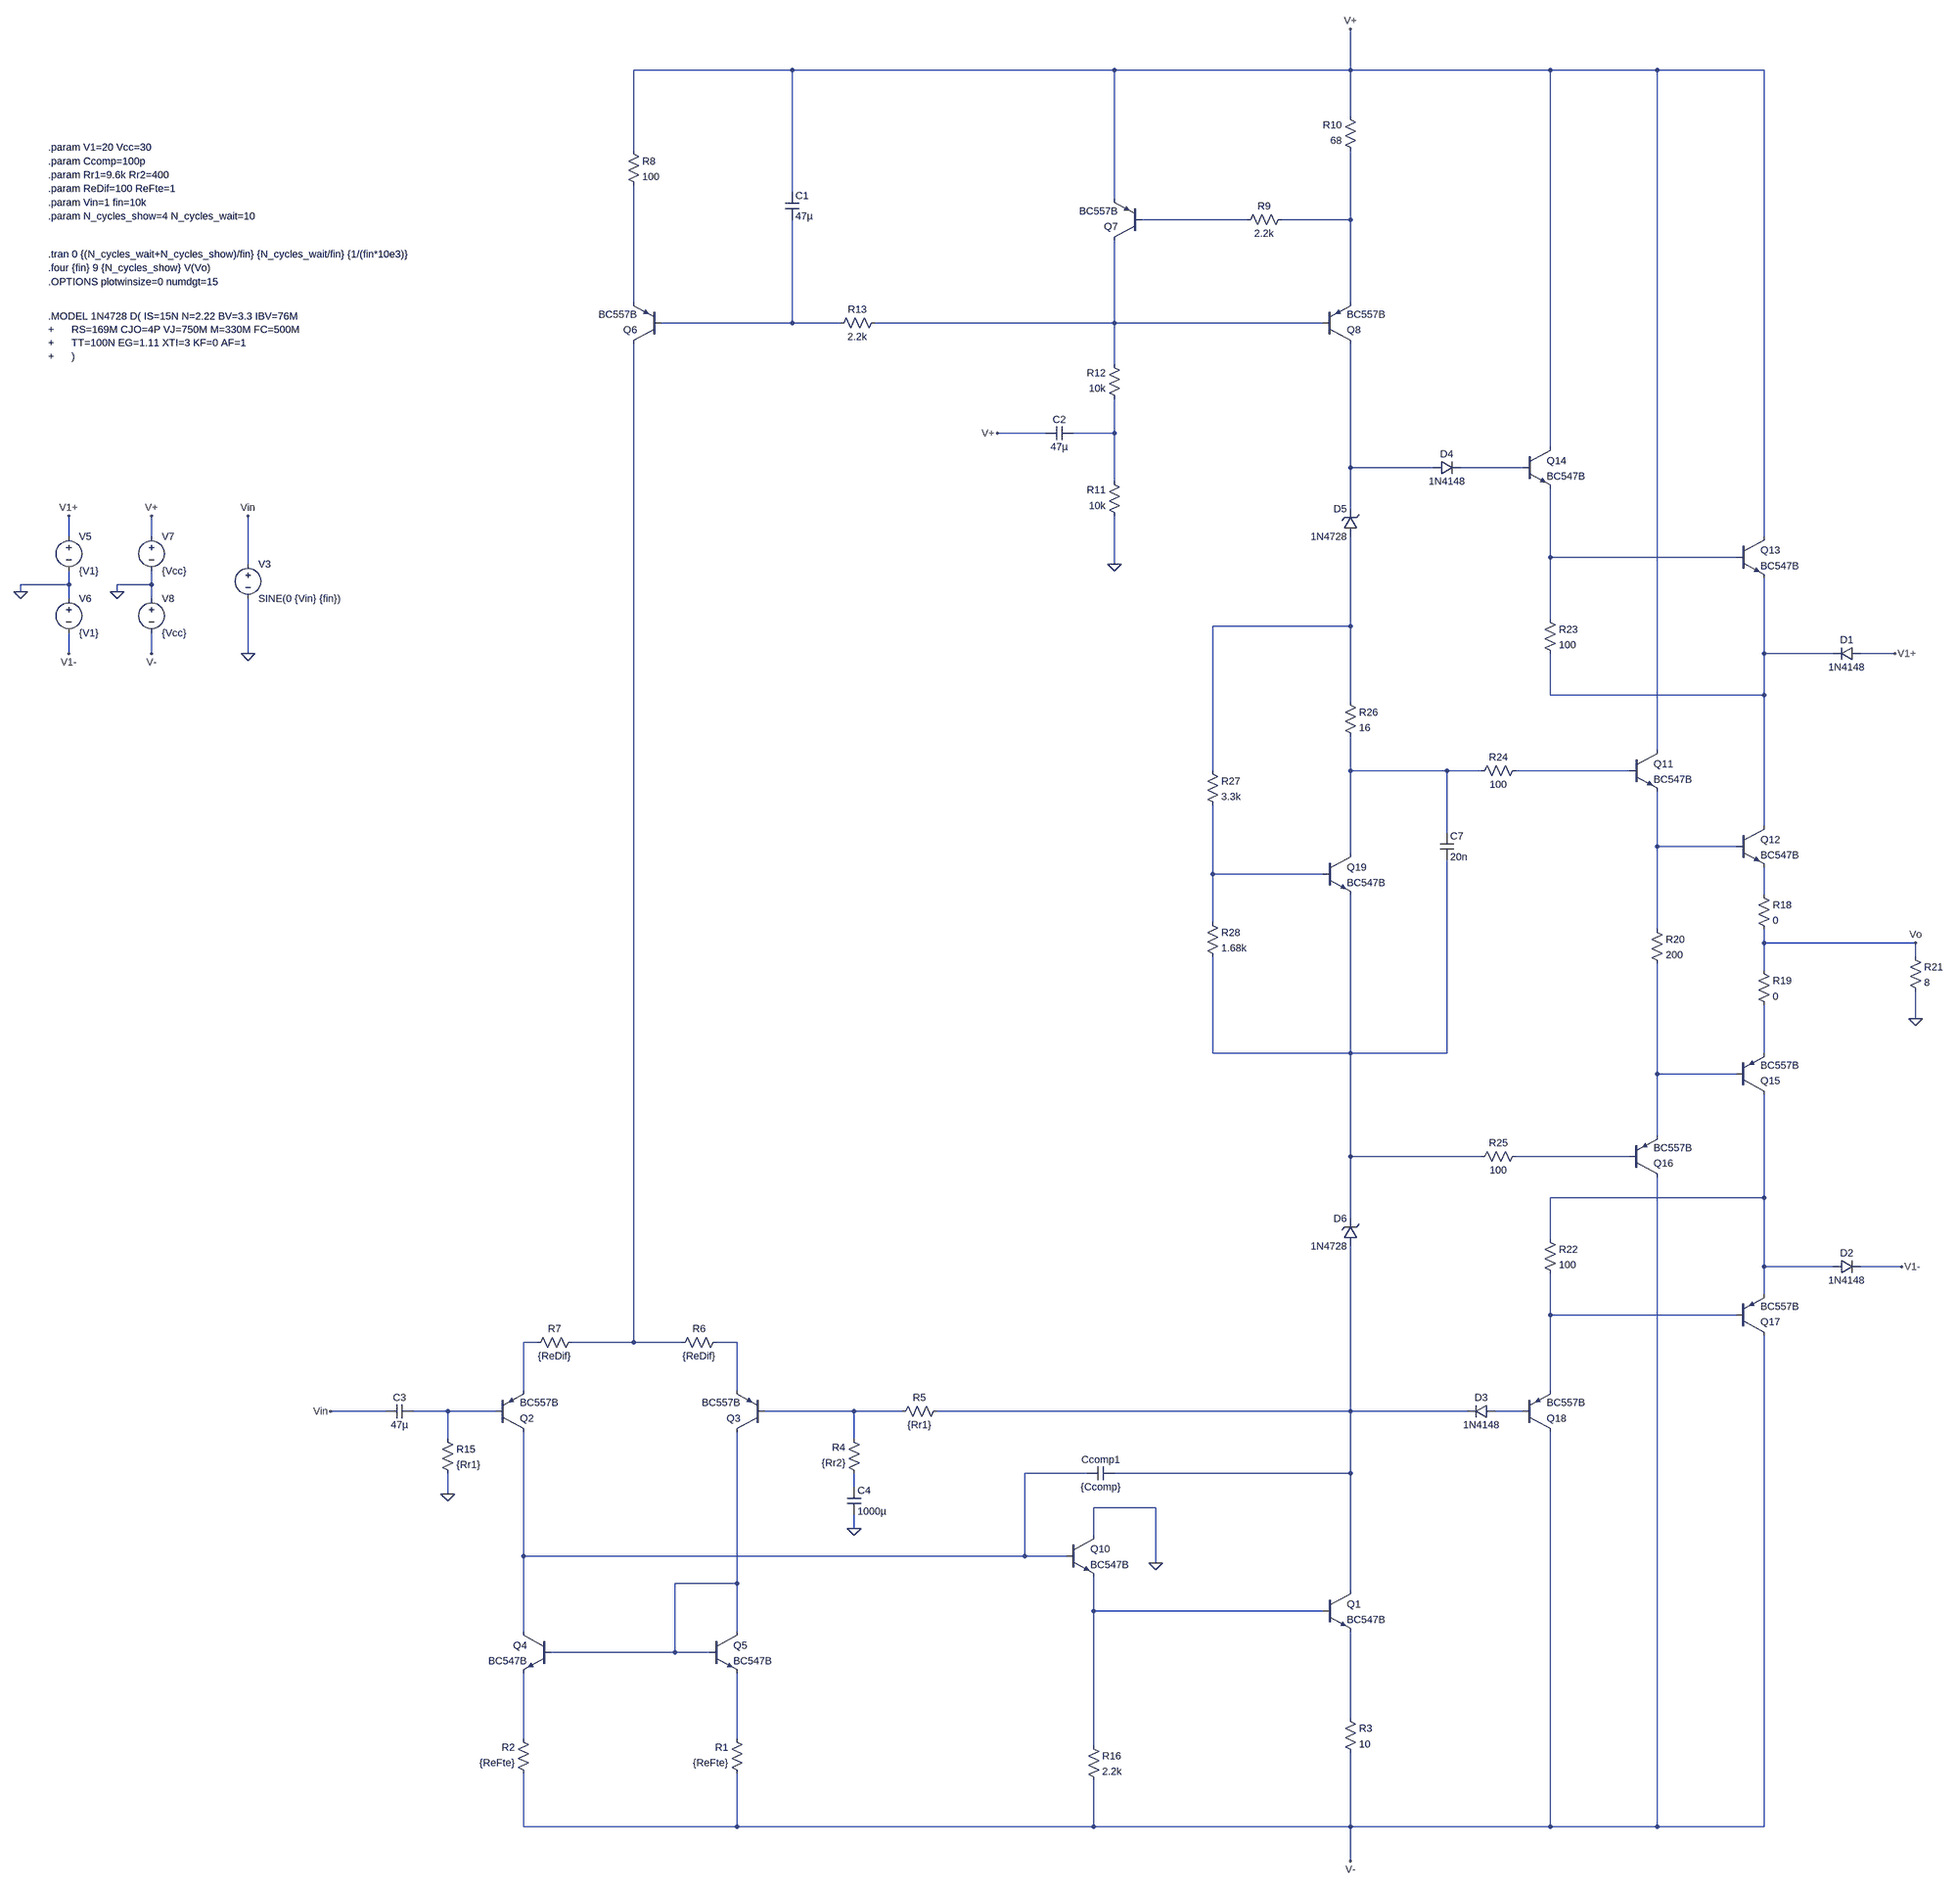
[diagram p0: schematic total.asc]
total.asc, the LTspice schematic file:
Version 4
SHEET 1 7264 2156
WIRE -1120 -2688 -1488 -2688
WIRE -368 -2688 -1120 -2688
WIRE 192 -2688 192 -2784
WIRE 192 -2688 -368 -2688
WIRE 656 -2688 192 -2688
WIRE 976 -2688 656 -2688
WIRE 1296 -2688 976 -2688
WIRE 192 -2576 192 -2688
WIRE -1488 -2496 -1488 -2688
WIRE -1120 -2400 -1120 -2688
WIRE -368 -2384 -368 -2688
WIRE -48 -2336 -304 -2336
WIRE 192 -2336 192 -2496
WIRE 192 -2336 32 -2336
WIRE -1488 -2144 -1488 -2416
WIRE 192 -2144 192 -2336
WIRE -1120 -2096 -1120 -2336
WIRE -1120 -2096 -1424 -2096
WIRE -1008 -2096 -1120 -2096
WIRE -368 -2096 -368 -2288
WIRE -368 -2096 -928 -2096
WIRE 128 -2096 -368 -2096
WIRE -368 -2000 -368 -2096
WIRE -528 -1840 -640 -1840
WIRE -368 -1840 -368 -1920
WIRE -368 -1840 -464 -1840
WIRE 656 -1808 656 -2688
WIRE 192 -1760 192 -2048
WIRE 384 -1760 192 -1760
WIRE 592 -1760 448 -1760
WIRE -368 -1728 -368 -1840
WIRE 192 -1664 192 -1760
WIRE -2800 -1600 -2800 -1648
WIRE -2608 -1600 -2608 -1648
WIRE 1296 -1600 1296 -2688
WIRE 656 -1552 656 -1712
WIRE 1232 -1552 656 -1552
WIRE -2384 -1536 -2384 -1648
WIRE -368 -1536 -368 -1648
WIRE -2800 -1488 -2800 -1520
WIRE -2800 -1488 -2912 -1488
WIRE -2608 -1488 -2608 -1520
WIRE -2608 -1488 -2688 -1488
WIRE -2912 -1472 -2912 -1488
WIRE -2688 -1472 -2688 -1488
WIRE -2800 -1456 -2800 -1488
WIRE -2608 -1456 -2608 -1488
WIRE 656 -1408 656 -1552
WIRE 192 -1392 192 -1600
WIRE 192 -1392 -128 -1392
WIRE -2800 -1328 -2800 -1376
WIRE -2608 -1328 -2608 -1376
WIRE -2384 -1328 -2384 -1456
WIRE 1296 -1328 1296 -1504
WIRE 1456 -1328 1296 -1328
WIRE 1600 -1328 1520 -1328
WIRE 656 -1232 656 -1328
WIRE 1296 -1232 1296 -1328
WIRE 1296 -1232 656 -1232
WIRE 192 -1216 192 -1392
WIRE 976 -1104 976 -2688
WIRE -128 -1056 -128 -1392
WIRE 192 -1056 192 -1136
WIRE 416 -1056 192 -1056
WIRE 496 -1056 416 -1056
WIRE 912 -1056 576 -1056
WIRE 1296 -928 1296 -1232
WIRE 416 -912 416 -1056
WIRE 976 -880 976 -1008
WIRE 1232 -880 976 -880
WIRE 192 -864 192 -1056
WIRE -128 -816 -128 -976
WIRE 128 -816 -128 -816
WIRE 1296 -768 1296 -832
WIRE -128 -704 -128 -816
WIRE 976 -688 976 -880
WIRE 1296 -656 1296 -688
WIRE 1648 -656 1296 -656
WIRE 1648 -624 1648 -656
WIRE 1296 -592 1296 -656
WIRE 1648 -480 1648 -544
WIRE -128 -400 -128 -624
WIRE 192 -400 192 -768
WIRE 192 -400 -128 -400
WIRE 416 -400 416 -848
WIRE 416 -400 192 -400
WIRE 1296 -400 1296 -512
WIRE 976 -352 976 -608
WIRE 1232 -352 976 -352
WIRE 976 -208 976 -352
WIRE 192 -160 192 -400
WIRE 496 -160 192 -160
WIRE 912 -160 576 -160
WIRE 1296 -64 1296 -304
WIRE 1296 -64 656 -64
WIRE 192 -16 192 -160
WIRE 656 32 656 -64
WIRE 1296 96 1296 -64
WIRE 1456 96 1296 96
WIRE 1616 96 1520 96
WIRE 1296 160 1296 96
WIRE 656 208 656 112
WIRE 1232 208 656 208
WIRE -1712 272 -1744 272
WIRE -1488 272 -1488 -2048
WIRE -1488 272 -1632 272
WIRE -1376 272 -1488 272
WIRE -1248 272 -1296 272
WIRE -1744 384 -1744 272
WIRE -1248 384 -1248 272
WIRE 656 384 656 208
WIRE -2064 432 -2192 432
WIRE -1920 432 -2000 432
WIRE -1808 432 -1920 432
WIRE -976 432 -1184 432
WIRE -864 432 -976 432
WIRE 192 432 192 48
WIRE 192 432 -784 432
WIRE 464 432 192 432
WIRE 592 432 528 432
WIRE -1920 496 -1920 432
WIRE -976 496 -976 432
WIRE -432 576 -576 576
WIRE 192 576 192 432
WIRE 192 576 -368 576
WIRE -976 608 -976 576
WIRE -1920 624 -1920 576
WIRE -272 656 -416 656
WIRE -976 704 -976 672
WIRE -416 720 -416 656
WIRE -1744 768 -1744 480
WIRE -576 768 -576 576
WIRE -576 768 -1744 768
WIRE -480 768 -576 768
WIRE -272 784 -272 656
WIRE -1248 832 -1248 480
WIRE -1248 832 -1392 832
WIRE 192 848 192 576
WIRE -416 896 -416 816
WIRE 128 896 -416 896
WIRE -1744 944 -1744 768
WIRE -1248 944 -1248 832
WIRE -1392 992 -1392 832
WIRE -1392 992 -1680 992
WIRE -1312 992 -1392 992
WIRE 192 1168 192 944
WIRE -1744 1216 -1744 1040
WIRE -1248 1216 -1248 1040
WIRE -416 1232 -416 896
WIRE -1744 1520 -1744 1296
WIRE -1248 1520 -1248 1296
WIRE -1248 1520 -1744 1520
WIRE -416 1520 -416 1312
WIRE -416 1520 -1248 1520
WIRE 192 1520 192 1248
WIRE 192 1520 -416 1520
WIRE 656 1520 656 480
WIRE 656 1520 192 1520
WIRE 976 1520 976 -112
WIRE 976 1520 656 1520
WIRE 1296 1520 1296 256
WIRE 1296 1520 976 1520
WIRE 192 1600 192 1520
FLAG -2384 -1328 0
FLAG -2384 -1648 Vin
FLAG -368 -1536 0
FLAG -640 -1840 V+
FLAG -976 704 0
FLAG -1920 624 0
FLAG -2192 432 Vin
FLAG -272 784 0
FLAG 192 1600 V-
FLAG 192 -2784 V+
FLAG 1648 -480 0
FLAG 1600 -1328 V1+
FLAG 1616 96 V1-
FLAG -2912 -1472 0
FLAG -2688 -1472 0
FLAG -2800 -1328 V1-
FLAG -2800 -1648 V1+
FLAG -2608 -1648 V+
FLAG -2608 -1328 V-
FLAG 1648 -656 Vo
DATAFLAG -1248 672 ""
DATAFLAG -1248 1136 "Ie(Q8)"
DATAFLAG -1744 1136 "Ie(Q7)"
DATAFLAG 192 1392 "I(R1)"
DATAFLAG -160 432 "I(R4)"
DATAFLAG 192 432 ""
DATAFLAG 192 704 "Ic(Q3)"
DATAFLAG -976 432 ""
DATAFLAG -1744 336 ""
DATAFLAG -1248 320 ""
DATAFLAG -1408 992 ""
DATAFLAG -1744 544 "Ic(Q1)"
DATAFLAG -1744 864 "Ic(Q7)"
DATAFLAG -1488 272 ""
DATAFLAG -1488 -1632 "Ic(Q4)"
DATAFLAG -1920 432 ""
DATAFLAG 192 -160 ""
DATAFLAG 192 -1392 ""
DATAFLAG 192 -1056 ""
DATAFLAG 1424 -656 ""
DATAFLAG 800 -1056 ""
DATAFLAG 784 -160 ""
DATAFLAG 976 -880 ""
SYMBOL res -1232 1312 R180
WINDOW 0 36 76 Left 2
WINDOW 3 36 40 Left 2
SYMATTR InstName R1
SYMATTR Value {ReFte}
SYMBOL res -1728 1312 R180
WINDOW 0 36 76 Left 2
WINDOW 3 36 40 Left 2
SYMATTR InstName R2
SYMATTR Value {ReFte}
SYMBOL npn 128 848 R0
SYMATTR InstName Q1
SYMATTR Value BC547B
SYMBOL voltage -2384 -1552 R0
WINDOW 123 0 0 Left 2
WINDOW 39 0 0 Left 2
SYMATTR InstName V3
SYMATTR Value SINE(0 {Vin} {fin})
SYMBOL res 176 1152 R0
SYMATTR InstName R3
SYMATTR Value 10
SYMBOL res -960 592 R180
WINDOW 0 36 76 Left 2
WINDOW 3 36 40 Left 2
SYMATTR InstName R4
SYMATTR Value {Rr2}
SYMBOL pnp -1808 480 M180
SYMATTR InstName Q2
SYMATTR Value BC557B
SYMBOL pnp -1184 480 R180
SYMATTR InstName Q3
SYMATTR Value BC557B
SYMBOL npn -1680 944 M0
SYMATTR InstName Q4
SYMATTR Value BC547B
SYMBOL npn -1312 944 R0
SYMATTR InstName Q5
SYMATTR Value BC547B
SYMBOL res -768 416 R90
WINDOW 0 0 56 VBottom 2
WINDOW 3 32 56 VTop 2
SYMATTR InstName R5
SYMATTR Value {Rr1}
SYMBOL res -1280 256 R90
WINDOW 0 0 56 VBottom 2
WINDOW 3 32 56 VTop 2
SYMATTR InstName R6
SYMATTR Value {ReDif}
SYMBOL res -1616 256 R90
WINDOW 0 0 56 VBottom 2
WINDOW 3 32 56 VTop 2
SYMATTR InstName R7
SYMATTR Value {ReDif}
SYMBOL pnp -1424 -2048 R180
SYMATTR InstName Q6
SYMATTR Value BC557B
SYMBOL pnp -304 -2288 R180
SYMATTR InstName Q7
SYMATTR Value BC557B
SYMBOL pnp 128 -2048 M180
SYMATTR InstName Q8
SYMATTR Value BC557B
SYMBOL cap -1136 -2400 R0
SYMATTR InstName C1
SYMATTR Value 47µ
SYMBOL cap -528 -1824 R270
WINDOW 0 32 32 VTop 2
WINDOW 3 0 32 VBottom 2
SYMATTR InstName C2
SYMATTR Value 47µ
SYMBOL res -1504 -2512 R0
SYMATTR InstName R8
SYMATTR Value 100
SYMBOL res 48 -2352 R90
WINDOW 0 0 56 VBottom 2
WINDOW 3 32 56 VTop 2
SYMATTR InstName R9
SYMATTR Value 2.2k
SYMBOL res 208 -2480 R180
WINDOW 0 36 76 Left 2
WINDOW 3 36 40 Left 2
SYMATTR InstName R10
SYMATTR Value 68
SYMBOL res -352 -1632 R180
WINDOW 0 36 76 Left 2
WINDOW 3 36 40 Left 2
SYMATTR InstName R11
SYMATTR Value 10k
SYMBOL res -352 -1904 R180
WINDOW 0 36 76 Left 2
WINDOW 3 36 40 Left 2
SYMATTR InstName R12
SYMATTR Value 10k
SYMBOL res -1024 -2080 R270
WINDOW 0 32 56 VTop 2
WINDOW 3 0 56 VBottom 2
SYMATTR InstName R13
SYMATTR Value 2.2k
SYMBOL res -1936 480 R0
SYMATTR InstName R15
SYMATTR Value {Rr1}
SYMBOL cap -2000 416 R90
WINDOW 0 0 32 VBottom 2
WINDOW 3 32 32 VTop 2
SYMATTR InstName C3
SYMATTR Value 47µ
SYMBOL cap -992 608 R0
SYMATTR InstName C4
SYMATTR Value 1000µ
SYMBOL npn -480 720 R0
SYMATTR InstName Q10
SYMATTR Value BC547B
SYMBOL res -432 1216 R0
SYMATTR InstName R16
SYMATTR Value 2.2k
SYMBOL cap -368 560 R90
WINDOW 0 0 32 VBottom 2
WINDOW 3 32 32 VTop 2
SYMATTR InstName Ccomp1
SYMATTR Value {Ccomp}
SYMBOL npn 912 -1104 R0
SYMATTR InstName Q11
SYMATTR Value BC547B
SYMBOL npn 1232 -928 R0
SYMATTR InstName Q12
SYMATTR Value BC547B
SYMBOL npn 1232 -1600 R0
SYMATTR InstName Q13
SYMATTR Value BC547B
SYMBOL npn 592 -1808 R0
SYMATTR InstName Q14
SYMATTR Value BC547B
SYMBOL res 1280 -784 R0
SYMATTR InstName R18
SYMATTR Value 0
SYMBOL res 1280 -608 R0
SYMATTR InstName R19
SYMATTR Value 0
SYMBOL pnp 1232 -304 M180
SYMATTR InstName Q15
SYMATTR Value BC557B
SYMBOL pnp 912 -112 M180
SYMATTR InstName Q16
SYMATTR Value BC557B
SYMBOL pnp 1232 256 M180
SYMATTR InstName Q17
SYMATTR Value BC557B
SYMBOL pnp 592 480 M180
SYMATTR InstName Q18
SYMATTR Value BC557B
SYMBOL res 960 -704 R0
SYMATTR InstName R20
SYMATTR Value 200
SYMBOL res 1632 -640 R0
SYMATTR InstName R21
SYMATTR Value 8
SYMBOL res 640 16 R0
SYMATTR InstName R22
SYMATTR Value 100
SYMBOL res 640 -1424 R0
SYMATTR InstName R23
SYMATTR Value 100
SYMBOL diode 1520 -1344 R90
WINDOW 0 0 32 VBottom 2
WINDOW 3 32 32 VTop 2
SYMATTR InstName D1
SYMATTR Value 1N4148
SYMBOL diode 1456 112 R270
WINDOW 0 32 32 VTop 2
WINDOW 3 0 32 VBottom 2
SYMATTR InstName D2
SYMATTR Value 1N4148
SYMBOL diode 528 416 R90
WINDOW 0 0 32 VBottom 2
WINDOW 3 32 32 VTop 2
SYMATTR InstName D3
SYMATTR Value 1N4148
SYMBOL diode 384 -1744 R270
WINDOW 0 32 32 VTop 2
WINDOW 3 0 32 VBottom 2
SYMATTR InstName D4
SYMATTR Value 1N4148
SYMBOL voltage -2800 -1616 R0
WINDOW 123 0 0 Left 0
WINDOW 39 0 0 Left 0
SYMATTR InstName V5
SYMATTR Value {V1}
SYMBOL voltage -2800 -1472 R0
WINDOW 123 0 0 Left 0
WINDOW 39 0 0 Left 0
SYMATTR InstName V6
SYMATTR Value {V1}
SYMBOL voltage -2608 -1616 R0
WINDOW 123 0 0 Left 0
WINDOW 39 0 0 Left 0
SYMATTR InstName V7
SYMATTR Value {Vcc}
SYMBOL voltage -2608 -1472 R0
WINDOW 123 0 0 Left 0
WINDOW 39 0 0 Left 0
SYMATTR InstName V8
SYMATTR Value {Vcc}
SYMBOL npn 128 -864 R0
SYMATTR InstName Q19
SYMATTR Value BC547B
SYMBOL res 592 -1072 R90
WINDOW 0 0 56 VBottom 2
WINDOW 3 32 56 VTop 2
SYMATTR InstName R24
SYMATTR Value 100
SYMBOL res 592 -176 R90
WINDOW 0 0 56 VBottom 2
WINDOW 3 32 56 VTop 2
SYMATTR InstName R25
SYMATTR Value 100
SYMBOL res 176 -1232 R0
SYMATTR InstName R26
SYMATTR Value 16
SYMBOL zener 208 -1600 R180
WINDOW 0 24 64 Left 2
WINDOW 3 24 0 Left 2
SYMATTR InstName D5
SYMATTR Value 1N4728
SYMBOL zener 208 48 R180
WINDOW 0 24 64 Left 2
WINDOW 3 24 0 Left 2
SYMATTR InstName D6
SYMATTR Value 1N4728
SYMBOL res -144 -1072 R0
SYMATTR InstName R27
SYMATTR Value 3.3k
SYMBOL res -144 -720 R0
SYMATTR InstName R28
SYMATTR Value 1.68k
SYMBOL cap 400 -912 R0
SYMATTR InstName C7
SYMATTR Value 20n
TEXT -2848 -2256 Left 2 !.tran 0 {(N_cycles_wait+N_cycles_show)/fin} {N_cycles_wait/fin} {1/(fin*10e3)}
TEXT -2848 -2224 Left 2 !.four {fin} 9 {N_cycles_show} V(Vo)
TEXT -2848 -2192 Left 2 !.OPTIONS plotwinsize=0 numdgt=15
TEXT -2848 -2344 Left 2 !.param N_cycles_show=4 N_cycles_wait=10
TEXT -2848 -2376 Left 2 !.param Vin=1 fin=10k
TEXT -2848 -2408 Left 2 !.param ReDif=100 ReFte=1
TEXT -2848 -2440 Left 2 !.param Rr1=9.6k Rr2=400
TEXT -2848 -2472 Left 2 !.param Ccomp=100p
TEXT -2848 -2504 Left 2 !.param V1=20 Vcc=30
TEXT -2848 -2112 Left 2 !.MODEL 1N4728 D( IS=15N N=2.22 BV=3.3 IBV=76M \n+      RS=169M CJO=4P VJ=750M M=330M FC=500M \n+      TT=100N EG=1.11 XTI=3 KF=0 AF=1 \n+      )

The netlist it stands for:
* total.asc
R1 V- N036 {ReFte}
R2 V- N035 {ReFte}
Q1 N028 N033 N034 0 BC547B
V3 Vin 0 SINE(0 {Vin} {fin})
R3 N034 V- 10
R4 N031 N027 {Rr2}
Q2 N030 N026 N023 0 BC557B
Q3 N032 N027 N025 0 BC557B
Q4 N030 N032 N035 0 BC547B
Q5 N032 N032 N036 0 BC547B
R5 N028 N027 {Rr1}
R6 N025 N024 {ReDif}
R7 N024 N023 {ReDif}
Q6 N024 N004 N003 0 BC557B
Q7 N005 N001 V+ 0 BC557B
Q8 N007 N005 N002 0 BC557B
C1 V+ N004 47µ
C2 V+ N006 47µ
R8 V+ N003 100
R9 N002 N001 2.2k
R10 N002 V+ 68
R11 0 N006 10k
R12 N006 N005 10k
R13 N004 N005 2.2k
R15 N026 0 {Rr1}
C3 N026 Vin 47µ
C4 N031 0 1000µ
Q10 0 N030 N033 0 BC547B
R16 N033 V- 2.2k
Ccomp1 N028 N030 {Ccomp}
Q11 V+ N013 N014 0 BC547B
Q12 N011 N014 N016 0 BC547B
Q13 V+ N009 N011 0 BC547B
Q14 V+ N008 N009 0 BC547B
R18 N016 Vo 0
R19 Vo N018 0
Q15 N021 N019 N018 0 BC557B
Q16 V- N020 N019 0 BC557B
Q17 V- N022 N021 0 BC557B
Q18 V- N029 N022 0 BC557B
R20 N014 N019 200
R21 Vo 0 8
R22 N021 N022 100
R23 N009 N011 100
D1 V1+ N011 1N4148
D2 N021 V1- 1N4148
D3 N029 N028 1N4148
D4 N007 N008 1N4148
V5 V1+ 0 {V1}
V6 0 V1- {V1}
V7 V+ 0 {Vcc}
V8 0 V- {Vcc}
Q19 N012 N015 N017 0 BC547B
R24 N013 N012 100
R25 N020 N017 100
R26 N010 N012 16
D5 N010 N007 1N4728
D6 N028 N017 1N4728
R27 N010 N015 3.3k
R28 N015 N017 1.68k
C7 N012 N017 20n
.model D D
.lib standard.dio
.model NPN NPN
.model PNP PNP
.lib standard.bjt
.tran 0 {(N_cycles_wait+N_cycles_show)/fin} {N_cycles_wait/fin} {1/(fin*10e3)}
.four {fin} 9 {N_cycles_show} V(Vo)
.OPTIONS plotwinsize=0 numdgt=15
.param N_cycles_show=4 N_cycles_wait=10
.param Vin=1 fin=10k
.param ReDif=100 ReFte=1
.param Rr1=9.6k Rr2=400
.param Ccomp=100p
.param V1=20 Vcc=30
.MODEL 1N4728 D( IS=15N N=2.22 BV=3.3 IBV=76M
+      RS=169M CJO=4P VJ=750M M=330M FC=500M
+      TT=100N EG=1.11 XTI=3 KF=0 AF=1
+      )
.backanno
.end